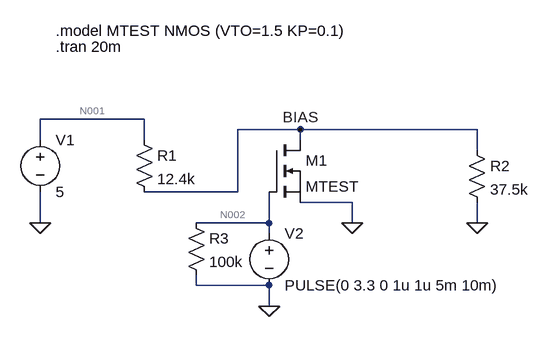
[diagram p0: schematic Simu_led_fluo.asc]
Simu_led_fluo.asc, the LTspice schematic file:
Version 4.1
SHEET 1 880 680
WIRE -192 -80 -352 -80
WIRE 48 -64 -48 -64
WIRE 320 -64 48 -64
WIRE -352 -48 -352 -80
WIRE -192 -48 -192 -80
WIRE 48 -48 48 -64
WIRE 320 -32 320 -64
WIRE -48 32 -48 -64
WIRE -48 32 -192 32
WIRE 128 48 48 48
WIRE -352 80 -352 32
WIRE 0 80 0 32
WIRE 0 80 -112 80
WIRE 128 80 128 48
WIRE 320 80 320 48
WIRE 0 96 0 80
WIRE -112 176 -112 160
WIRE 0 176 -112 176
WIRE 0 208 0 176
FLAG -352 80 0
FLAG 0 208 0
FLAG 128 80 0
FLAG 320 80 0
FLAG 48 -64 BIAS
SYMBOL voltage -352 -64 R0
SYMATTR InstName V1
SYMATTR Value 5
SYMBOL res -208 -64 R0
SYMATTR InstName R1
SYMATTR Value 12.4k
SYMBOL voltage 0 80 R0
WINDOW 123 0 0 Left 0
WINDOW 39 0 0 Left 0
SYMATTR InstName V2
SYMATTR Value PULSE(0 3.3 0 1u 1u 5m 10m)
SYMBOL nmos 0 -48 R0
SYMATTR InstName M1
SYMATTR Value MTEST
SYMBOL res 304 -48 R0
SYMATTR InstName R2
SYMATTR Value 37.5k
SYMBOL res -128 64 R0
SYMATTR InstName R3
SYMATTR Value 100k
TEXT -328 -216 Left 2 !.model MTEST NMOS (VTO=1.5 KP=0.1)
TEXT -328 -192 Left 2 !.tran 20m

The netlist it stands for:
* Simu_led_fluo.asc
V1 N001 0 5
R1 N001 BIAS 12.4k
V2 N002 0 PULSE(0 3.3 0 1u 1u 5m 10m)
M1 BIAS N002 0 0 MTEST
R2 BIAS 0 37.5k
R3 N002 0 100k
.model NMOS NMOS
.model PMOS PMOS
.lib standard.mos
.model MTEST NMOS (VTO=1.5 KP=0.1)
.tran 20m
.backanno
.end

* Results of the author's LTspice run, read from the files saved beside the schematic
* Operating Point, zero values left out:
*   V(bias) = 3.758 V
*   V(n001) = 5 V
*   I(R1) = 100.2 µA
*   I(R2) = 100.2 µA
*   I(V1) = -100.2 µA
*   Ib(M1) = -3.768 pA
*   Id(M1) = 7.525 pA
*   Is(M1) = -3.758 pA
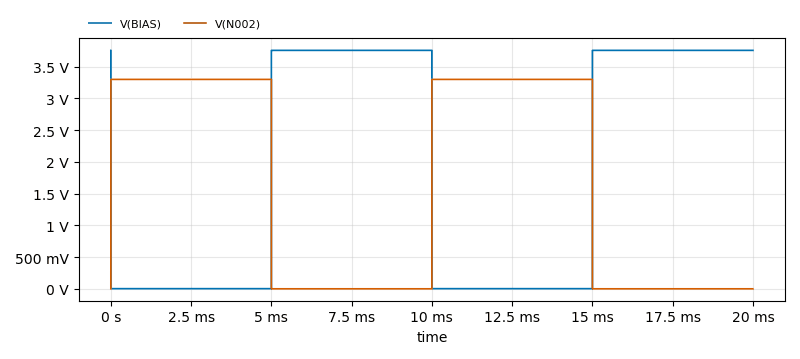
[diagram p1: Transient Analysis of Simu_led_fluo.asc, plotted from the saved traces]
* Transient Analysis, 1 run:
*   V(BIAS): min 2.24 mV, max 3.758 V, average 1.88 V, rms 2.657 V, last 3.758 V
*   V(N002): min 0 V, max 3.3 V, average 1.65 V, rms 2.334 V, last 0 V